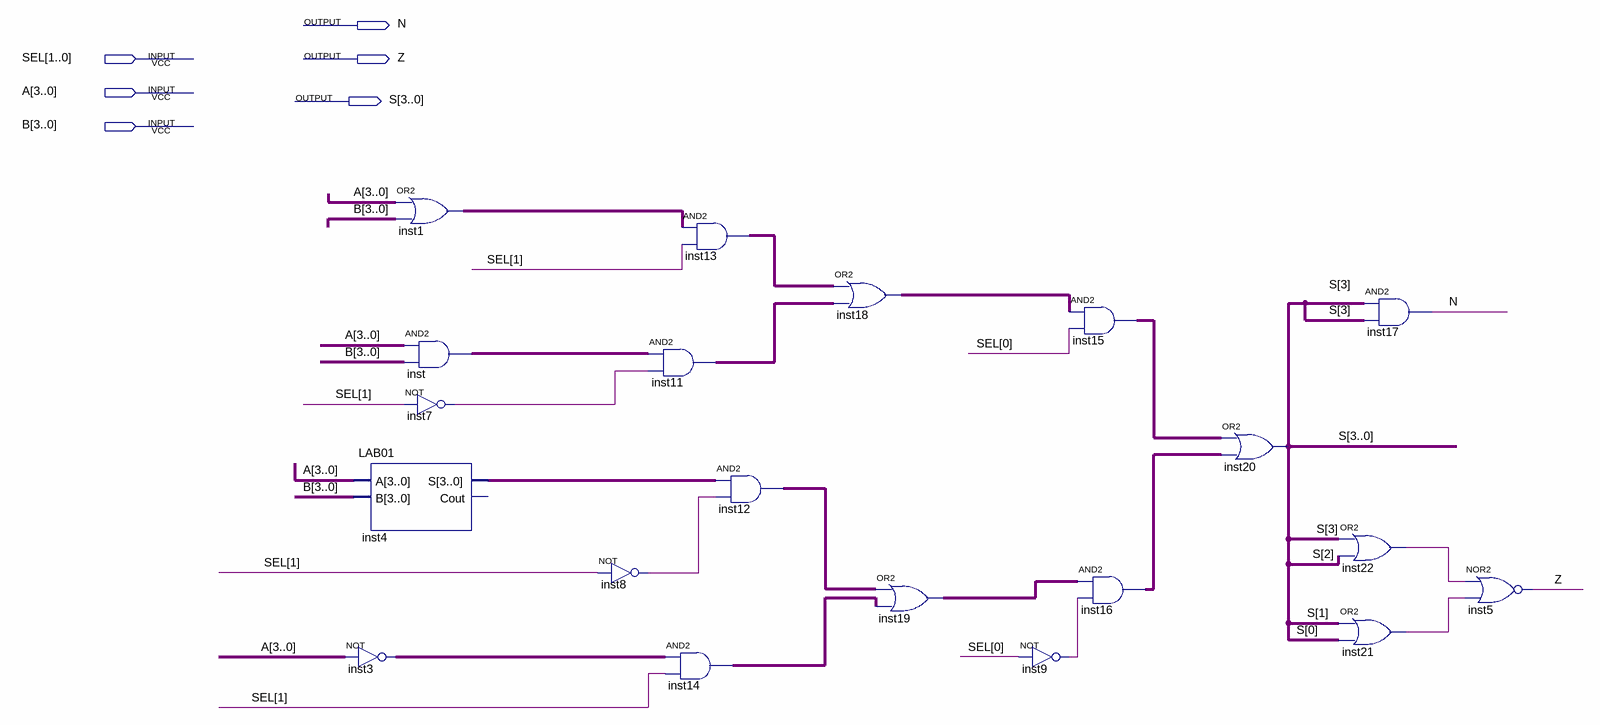
[diagram p0: schematic sheet]
// Quartus schematic lab03.bdf as structural Verilog: 20 symbols, 6 pins
module lab03 (
  input  [1:0] SEL,
  input  [3:0] A,
  input  [3:0] B,
  output N,
  output Z,
  output [3:0] S
);

  wire inst7_out, inst8_out, inst9_out, inst21_out, inst22_out;
  wire [3:0] inst1_out, inst3_out, inst4_s, inst11_out, inst12_out, inst13_out, inst14_out, inst15_out,
       inst16_out, inst18_out, inst19_out, inst_out;

  assign inst1_out = A | B;  // OR2 inst1, 4 bits wide
  LAB01 inst4 (.A(A), .B(B), .S(inst4_s));  // open: Cout
  assign inst3_out = ~A;  // NOT inst3, 4 bits wide
  assign inst_out = A & B;  // AND2 inst, 4 bits wide
  not inst7 (inst7_out, SEL[1]);
  not inst8 (inst8_out, SEL[1]);
  assign inst11_out = inst_out & {4{inst7_out}};  // AND2 inst11, 4 bits wide
  assign inst14_out = inst3_out & {4{SEL[1]}};  // AND2 inst14, 4 bits wide
  assign inst13_out = inst1_out & {4{SEL[1]}};  // AND2 inst13, 4 bits wide
  assign inst12_out = inst4_s & {4{inst8_out}};  // AND2 inst12, 4 bits wide
  assign inst18_out = inst13_out | inst11_out;  // OR2 inst18, 4 bits wide
  assign inst19_out = inst12_out | inst14_out;  // OR2 inst19, 4 bits wide
  assign inst15_out = inst18_out & {4{SEL[0]}};  // AND2 inst15, 4 bits wide
  not inst9 (inst9_out, SEL[0]);
  assign inst16_out = inst19_out & {4{inst9_out}};  // AND2 inst16, 4 bits wide
  assign S = inst15_out | inst16_out;  // OR2 inst20, 4 bits wide
  or inst22 (inst22_out, S[3], S[2]);
  or inst21 (inst21_out, S[1], S[0]);
  and inst17 (N, S[3], S[3]);
  nor inst5 (Z, inst22_out, inst21_out);
endmodule
